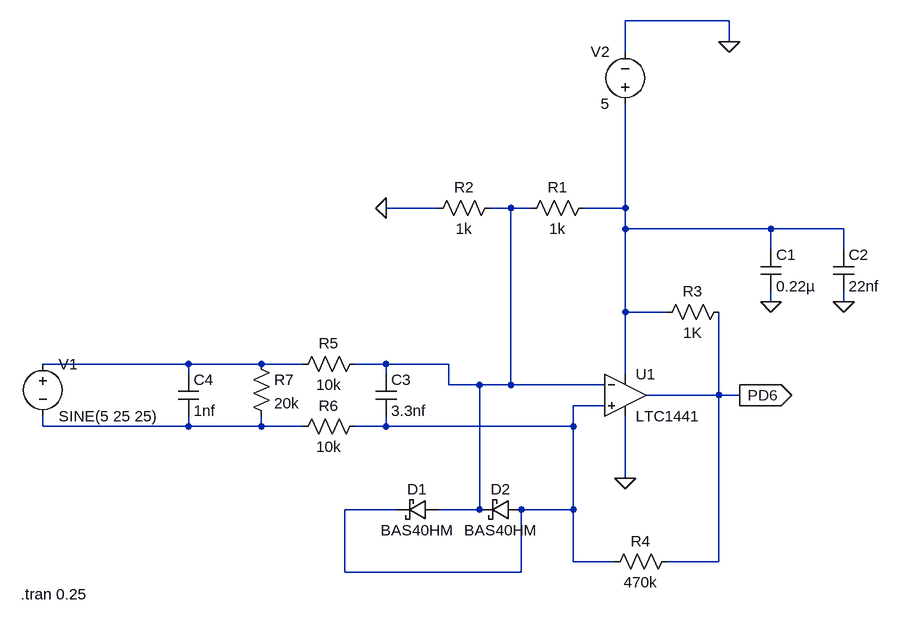
[diagram p0: schematic Преобразователь сигнала индуктивного датчика.asc]
Преобразователь сигнала индуктивного датчика.asc, the LTspice schematic file:
Version 4
SHEET 1 880 680
WIRE 352 -400 192 -400
WIRE 352 -368 352 -400
WIRE 192 -352 192 -400
WIRE -96 -112 -176 -112
WIRE 16 -112 -16 -112
WIRE 48 -112 16 -112
WIRE 192 -112 192 -272
WIRE 192 -112 128 -112
WIRE 192 -80 192 -112
WIRE 416 -80 192 -80
WIRE 528 -80 416 -80
WIRE 416 -48 416 -80
WIRE 528 -48 528 -80
WIRE 416 32 416 16
WIRE 528 32 528 16
WIRE 192 48 192 -80
WIRE 256 48 192 48
WIRE -480 128 -704 128
WIRE -368 128 -480 128
WIRE -304 128 -368 128
WIRE -176 128 -224 128
WIRE -80 128 -176 128
WIRE -480 144 -480 128
WIRE -176 144 -176 128
WIRE 192 144 192 48
WIRE -80 160 -80 128
WIRE -32 160 -80 160
WIRE 16 160 16 -112
WIRE 16 160 -32 160
WIRE 160 160 16 160
WIRE 336 176 336 48
WIRE 336 176 224 176
WIRE 368 176 336 176
WIRE 160 192 112 192
WIRE -704 224 -704 208
WIRE -480 224 -480 208
WIRE -480 224 -704 224
WIRE -368 224 -368 208
WIRE -368 224 -480 224
WIRE -304 224 -368 224
WIRE -176 224 -176 208
WIRE -176 224 -224 224
WIRE 112 224 112 192
WIRE 112 224 -176 224
WIRE 192 304 192 208
WIRE -160 352 -240 352
WIRE -32 352 -32 160
WIRE -32 352 -96 352
WIRE 112 352 112 224
WIRE 112 352 32 352
WIRE 112 432 112 352
WIRE 176 432 112 432
WIRE 336 432 336 176
WIRE 336 432 256 432
WIRE -240 448 -240 352
WIRE 32 448 32 352
WIRE 32 448 -240 448
FLAG 192 304 0
FLAG 368 176 PD6
IOPIN 368 176 Out
FLAG -176 -112 0
FLAG 416 32 0
FLAG 528 32 0
FLAG 352 -368 0
SYMBOL Comparators\\LTC1441 192 112 R0
SYMATTR InstName U1
SYMBOL res 144 -128 R90
WINDOW 0 0 56 VBottom 2
WINDOW 3 32 56 VTop 2
SYMATTR InstName R1
SYMATTR Value 1k
SYMBOL res 0 -128 R90
WINDOW 0 0 56 VBottom 2
WINDOW 3 32 56 VTop 2
SYMATTR InstName R2
SYMATTR Value 1k
SYMBOL res 352 32 R90
WINDOW 0 0 56 VBottom 2
WINDOW 3 32 56 VTop 2
SYMATTR InstName R3
SYMATTR Value 1K
SYMATTR SpiceLine tol=1 pwr=0.1
SYMBOL cap 400 -48 R0
SYMATTR InstName C1
SYMATTR Value 0.22µ
SYMATTR SpiceLine V=4 Irms=3.56 Rser=0.0381287 Lser=0 mfg="KEMET" pn="C0402C224K7PAC" type="X5R"
SYMBOL cap 512 -48 R0
SYMATTR InstName C2
SYMATTR Value 22nf
SYMBOL res 272 416 R90
WINDOW 0 0 56 VBottom 2
WINDOW 3 32 56 VTop 2
SYMATTR InstName R4
SYMATTR Value 470k
SYMBOL schottky -96 336 R90
WINDOW 0 0 32 VBottom 2
WINDOW 3 32 32 VTop 2
SYMATTR InstName D1
SYMATTR Value BAS40HM
SYMATTR Description Diode
SYMATTR Type diode
SYMBOL schottky 32 336 R90
WINDOW 0 0 32 VBottom 2
WINDOW 3 32 32 VTop 2
SYMATTR InstName D2
SYMATTR Value BAS40HM
SYMATTR Description Diode
SYMATTR Type diode
SYMBOL cap -192 144 R0
SYMATTR InstName C3
SYMATTR Value 3.3nf
SYMBOL res -208 112 R90
WINDOW 0 0 56 VBottom 2
WINDOW 3 32 56 VTop 2
SYMATTR InstName R5
SYMATTR Value 10k
SYMBOL res -208 208 R90
WINDOW 0 0 56 VBottom 2
WINDOW 3 32 56 VTop 2
SYMATTR InstName R6
SYMATTR Value 10k
SYMBOL res -384 112 R0
SYMATTR InstName R7
SYMATTR Value 20k
SYMBOL cap -496 144 R0
SYMATTR InstName C4
SYMATTR Value 1nf
SYMATTR SpiceLine V=500
SYMBOL voltage -704 112 R0
WINDOW 123 24 124 Left 2
WINDOW 39 0 0 Left 0
SYMATTR InstName V1
SYMATTR Value SINE(5 25 25)
SYMBOL voltage 192 -256 R180
WINDOW 0 24 96 Left 2
WINDOW 3 24 16 Left 2
WINDOW 123 0 0 Left 0
WINDOW 39 0 0 Left 0
SYMATTR InstName V2
SYMATTR Value 5
TEXT -738 482 Left 2 !.tran 0.25

The netlist it stands for:
* Преобразователь сигнала индуктивного датчика.asc
XU1 N004 N001 N002 0 PD6 LTC1441  ; pins In+ In- V+ V- OUT
R1 N002 N001 1k
R2 N001 0 1k
R3 PD6 N002 1K tol=1 pwr=0.1
C1 N002 0 0.22µ V=4 Irms=3.56 Rser=0.0381287 Lser=0 mfg="KEMET" pn="C0402C224K7PAC" type="X5R"
C2 N002 0 22nf
R4 PD6 N004 470k
D1 N001 N004 BAS40HM
D2 N004 N001 BAS40HM
C3 N001 N004 3.3nf
R5 N001 N003 10k
R6 N004 N005 10k
R7 N003 N005 20k
C4 N003 N005 1nf V=500
V1 N003 N005 SINE(5 25 25)
V2 N002 0 5
.model D D
.lib standard.dio
.tran 0.25
.backanno
.end